# EAGLE design untitled (EAGLE 9.4.2)
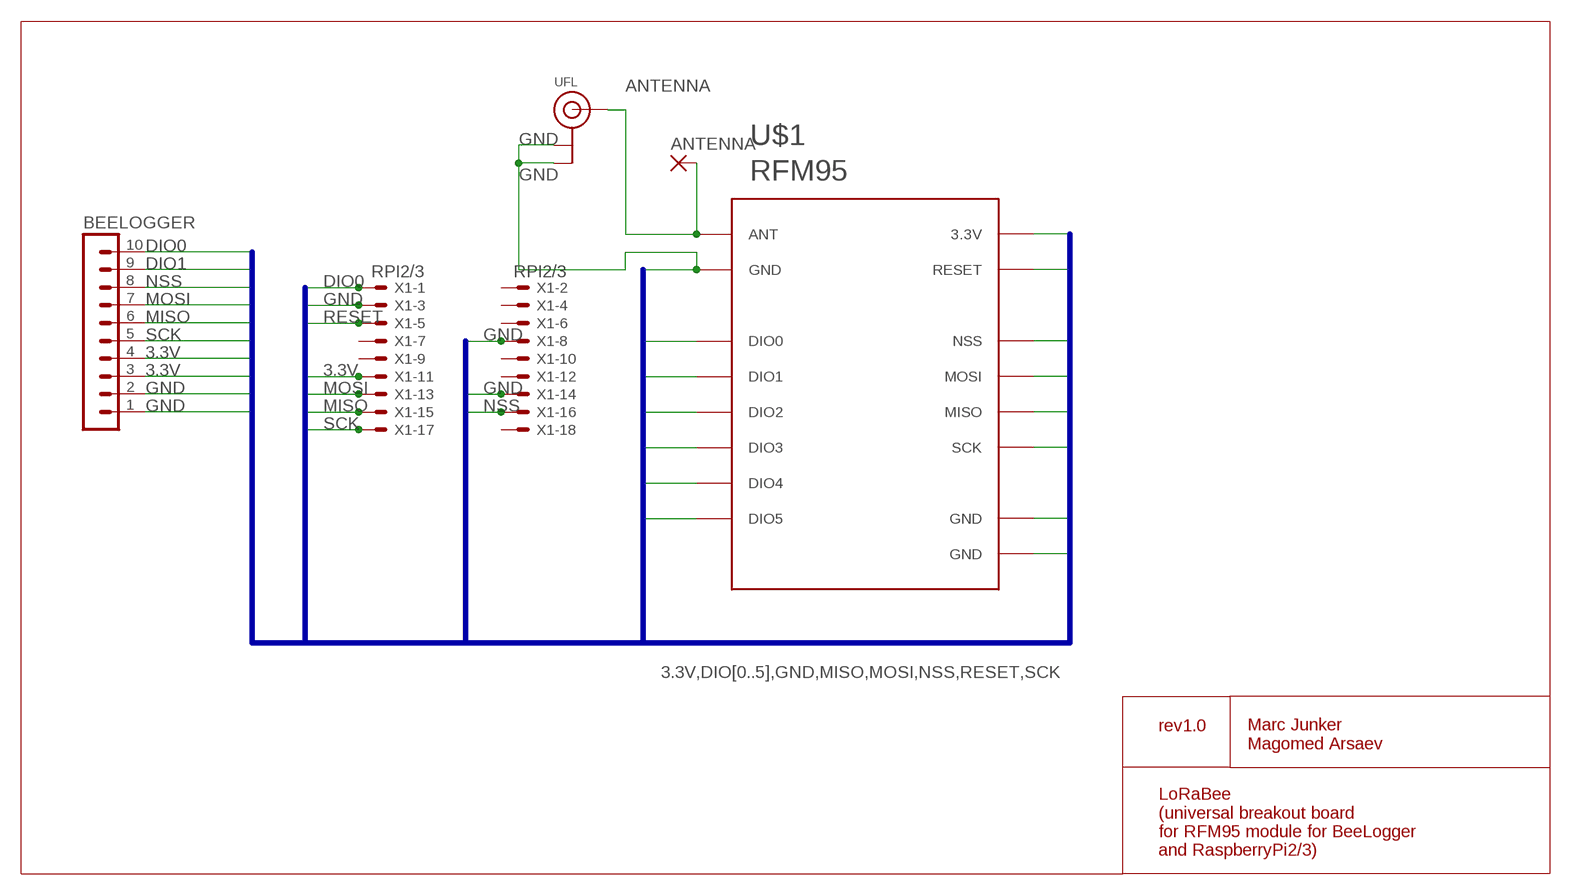
[diagram p0: schematic, sheet 1]

## Parts
ANTENNA  1,6/0,8  [1,6/0,8]
BEELOGGER  MA10-1  [MA10-1]
U$1  RFM95  [RFM95]
UFL  ANTENNA_U.FL  [U.FL]
X1  RPI2/3  332-18  [332-18]

## Nets
3.3V: BEELOGGER.3 BEELOGGER.4 U$1.P$13(3.3V) X1.11
ANTENNA: ANTENNA.1(P) U$1.P$9(ANT) UFL.3(SIGNAL)
DIO0: BEELOGGER.10 U$1.P$14(DIO0) X1.1
DIO1: BEELOGGER.9 U$1.P$15(DIO1)
DIO2: U$1.P$16(DIO2)
DIO3: U$1.P$11(DIO3)
DIO4: U$1.P$12(DIO4)
DIO5: U$1.P$7(DIO5)
GND: BEELOGGER.1 BEELOGGER.2 U$1.P$1(GND) U$1.P$8(GND) U$1.P$10(GND) UFL.1(GND) UFL.2(GND) X1.3 X1.8 X1.14
MISO: BEELOGGER.6 U$1.P$2(MISO) X1.15
MOSI: BEELOGGER.7 U$1.P$3(MOSI) X1.13
NSS: BEELOGGER.8 U$1.P$5(NSS) X1.16
RESET: U$1.P$6(RESET) X1.5
SCK: BEELOGGER.5 U$1.P$4(SCK) X1.17
Unconnected: X1.2 X1.4 X1.6 X1.7 X1.9 X1.10 X1.12 X1.18

## Buses
3.3V,DIO[0..5],GND,MISO,MOSI,NSS,RESET,SCK

## Notes on the sheet
- rev1.0
- Marc Junker
  Magomed Arsaev
- LoRaBee 
  (universal breakout board 
  for RFM95 module for BeeLogger 
  and RaspberryPi2/3)

## Library data of the parts
ANTENNA = wirepad:1,6/0,8: THROUGH-HOLE PAD
BEELOGGER = con-lstb:MA10-1: PIN HEADER; OC_FARNELL: unknown; OC_NEWARK: unknown
U$1 = LoRa_modules:RFM95
UFL = adafruit:ANTENNA_U.FL: U.FL Antenna Connector
X1 = con-garry:332-18: 18 Pin - 2mm Dual Row Source: www.mpe-connector.de / garry_shortform_2012.pdf

## Board
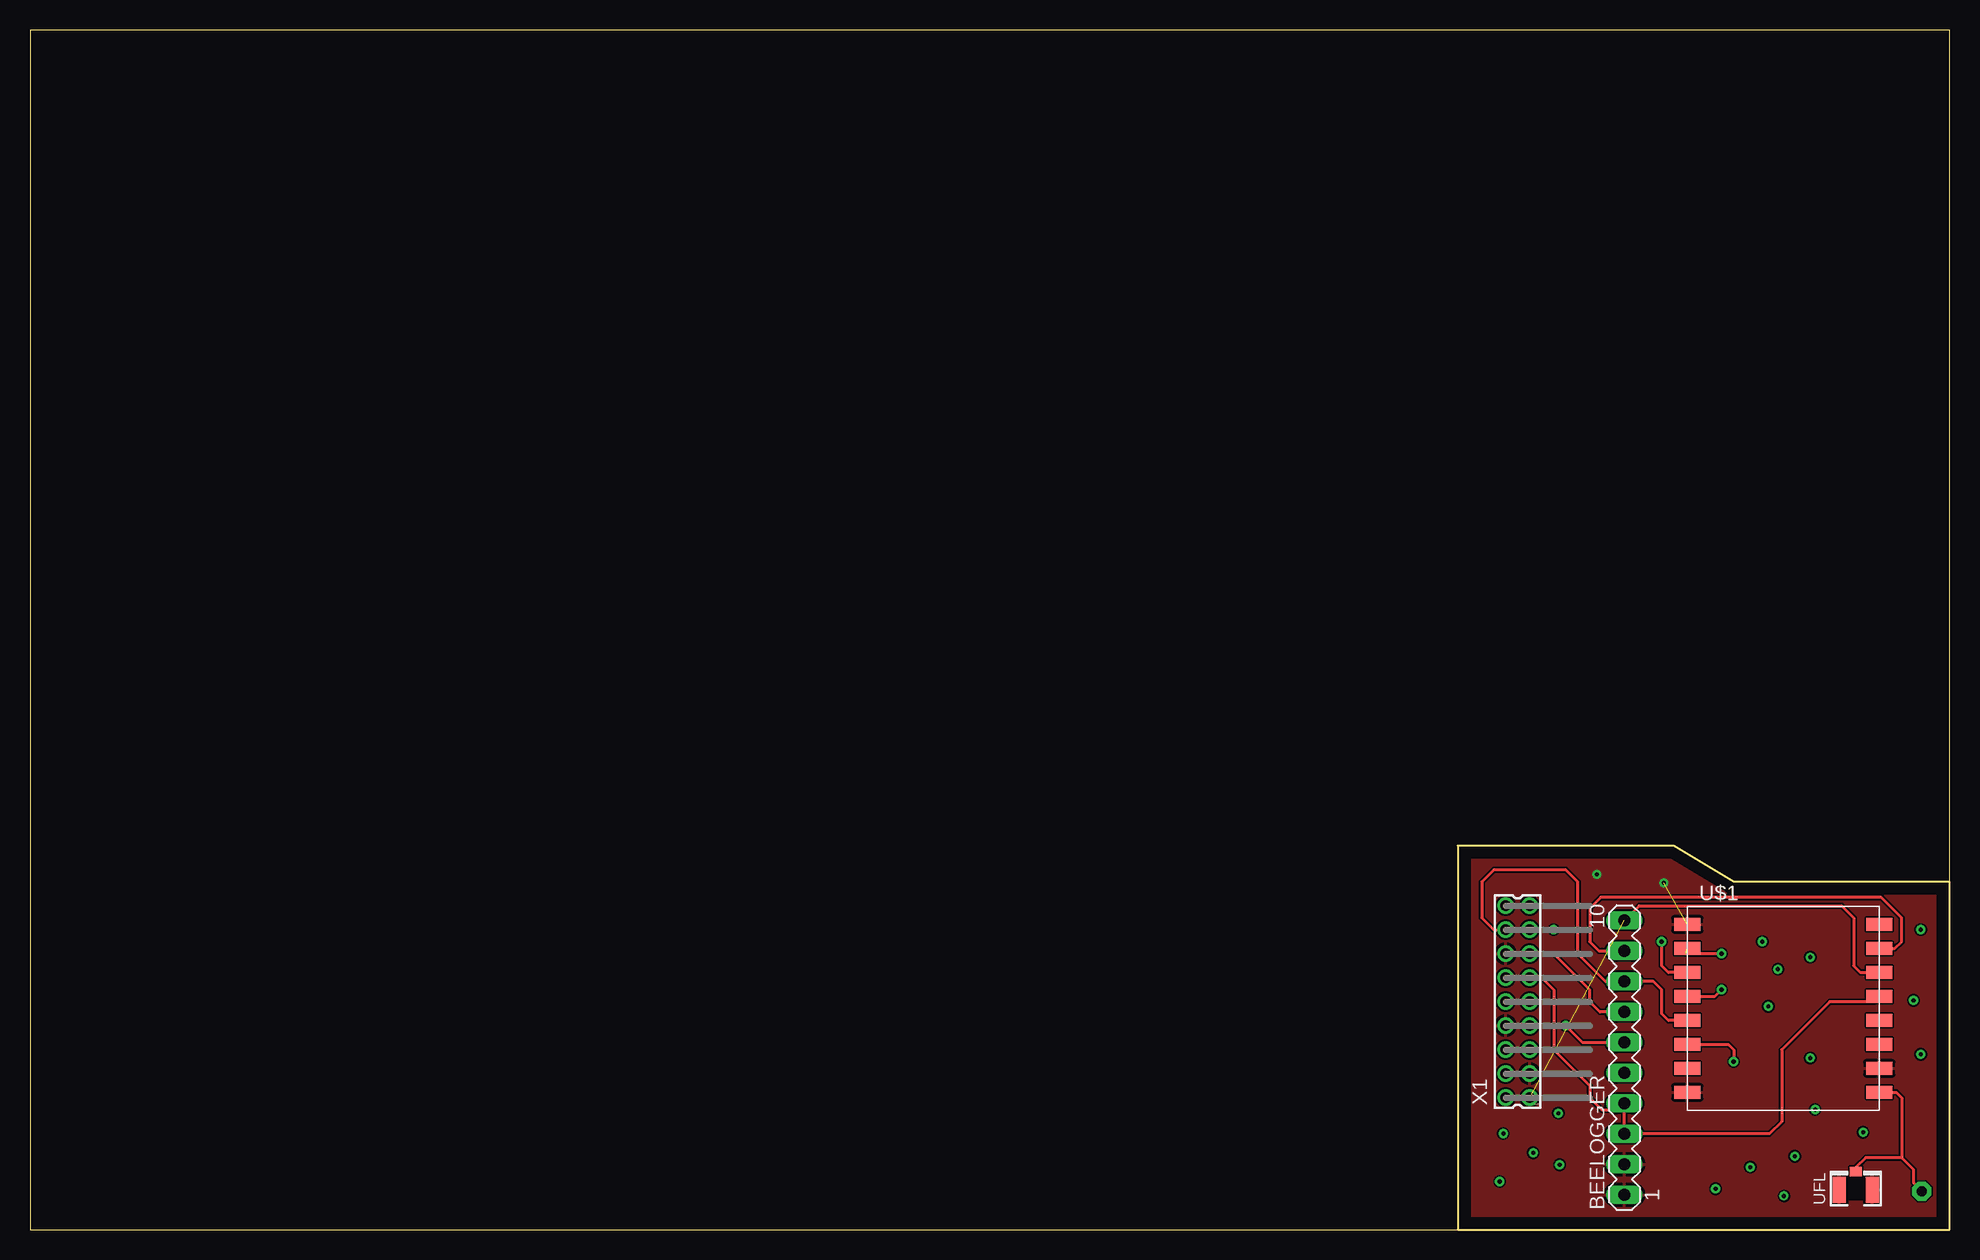
[diagram p1: board, top side]
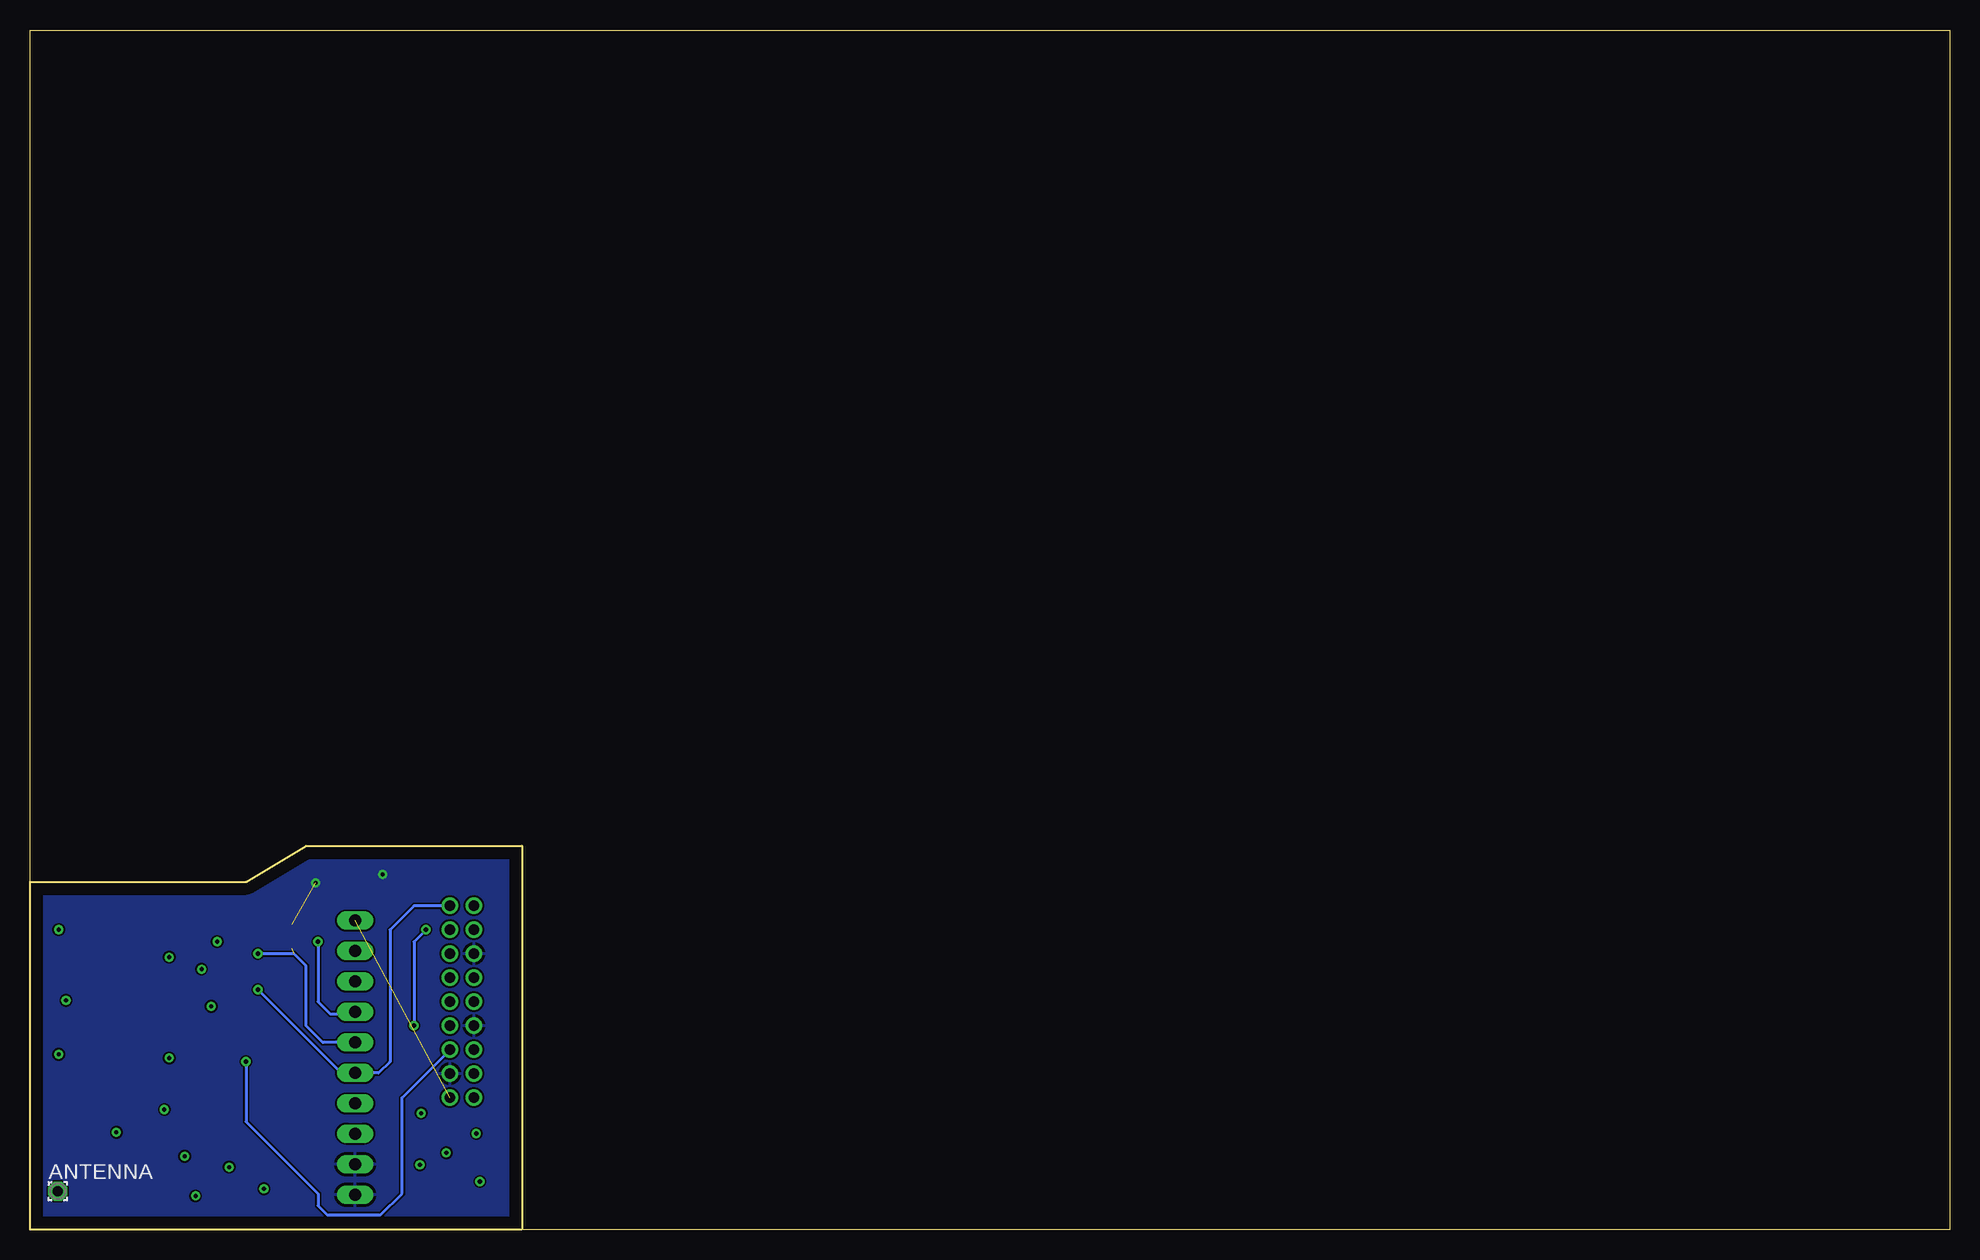
[diagram p2: board, bottom side, seen from below]

Size 160 x 100 mm. Coordinates in mm from the lower left corner, seen from the top.
Outline: 119,0 0,0 0,100 160,100 160,29
Outline: 160,29 160,0 119,0
Outline: 160,29 142,29 137,32 119,32 119,0
Copper layers (1*16): Top 0.035mm / dielectric 1.5mm / Bottom 0.035mm
Design rules "default": minimum track width 6mil, minimum drill 0.35mm, track to track 6mil, track to pad 6mil, pad to pad 6mil, via to via 6mil, smd to smd 6mil, copper to edge 40mil, drill to drill 6mil, minimum pad ring 10mil, minimum via ring 8mil, stop-mask expansion 4mil, vias tented up to drill 0mil, thermal gap 10mil

### Footprints (pad centres in the part's own frame; a part is rotated, then mirrored left to right if it is on the bottom)
1,6/0,8 = drill 0.813 pad 1.6 octagon: 1 0,0
MA10-1 = drill 1.016 long: 1 -11.43,0; 2 -8.89,0; 3 -6.35,0; 4 -3.81,0; 5 -1.27,0; 6 1.27,0; 7 3.81,0; 8 6.35,0; 9 8.89,0; 10 11.43,0
RFM95 = smd 2.184 x 1.067: P$1 -8,7; P$2 -8,5; P$3 -8,3; P$4 -8,1; P$5 -8,-1; P$6 -8,-3; P$7 -8,-5; P$8 -8,-7; P$9 8,-7; P$10 8,-5; P$11 8,-3; P$12 8,-1; P$13 8,1; P$14 8,3; P$15 8,5; P$16 8,7
U.FL = smd 2.2 x 1.05: 1 0,1.375; 2 0,-1.375 | smd 0.8 x 1: 3 1.525,0
332-18 = drill 0.9 pad 1.27: 1 -8,-1; 2 -8,1; 3 -6,-1; 4 -6,1; 5 -4,-1; 6 -4,1; 7 -2,-1; 8 -2,1; 9 0,-1; 10 0,1; 11 2,-1; 12 2,1; 13 4,-1; 14 4,1; 15 6,-1; 16 6,1; 17 8,-1; 18 8,1

### Placement (x,y rotation side)
ANTENNA  157.69,3.19 0 bottom
BEELOGGER  132.9,14.33 90 top
U$1  146.14,18.43 0 top
UFL  152.19,3.31 90 top
X1  124,19 90 top

### Tracks (layer width: path | path; a pad name or v marks a point on that pad's centre or on a via)
3.3V
  Top 0.254: 132.9,10 BEELOGGER.3 144.98,7.98 146,9 146,15 150,19 153.71,19 U$1.P$13 | 132.9,10 BEELOGGER.4 | X1.11 126,21 127,20 127,15 130,12 130,11 131,10 132.9,10
ANTENNA
  Top 0.254: ANTENNA.1 157,3.88 157,5 156,6 | 156,6 153,6 152.19,5.19 UFL.3 | U$1.P$9 155.57,11.43 156,11 156,6
DIO0  (1 unrouted)
  Top 0.254: BEELOGGER.10 134.14,27 151,27 152,26 152,22 152.57,21.43 U$1.P$14
DIO1
  Top 0.254: U$1.P$15 155.43,23.43 156,24 156,26 154.3,27.7 130.92,27.7 130,26.78 130,24 130.78,23.22 BEELOGGER.9
GND  (via drill 0.35)  (1 unrouted)
  other vias: 130.6,29.6 136.2,28.9
  pour Top: 159,29 142,29 137,32 119,32 119,0 160,0 160,29
  pour Bottom: 119,32 137,32 142,29 160,29 160,0 119,0
MISO  (via drill 0.35)  (1 unrouted)
  Top 0.254: v141,23 138,23 | X1.15 v127,25 | v128,17 129.4,15.6 BEELOGGER.6
  Bottom 0.254: BEELOGGER.6 135.6,15.6 137,17 137,22 138,23 v141,23 | v127,25 128,24 v128,17
MOSI  (via drill 0.35)
  Top 0.254: U$1.P$3 136.57,21.43 136,22 v136,24 | BEELOGGER.7 130.86,18.14 130,19 130,20 127,23 X1.13
  Bottom 0.254: BEELOGGER.7 133.04,18 135,18 136,19 v136,24
N$1  (via drill 0.35)
  other vias: 127.4,9.7
N$2  (via drill 0.35)
  other vias: 122.8,8
N$3  (via drill 0.35)
  other vias: 125.3,6.4
N$4  (via drill 0.35)
  other vias: 127.5,5.4
N$5  (via drill 0.35)
  other vias: 122.5,4
N$6  (via drill 0.35)
  other vias: 140.5,3.4
N$7  (via drill 0.35)
  other vias: 146.2,2.8
N$8  (via drill 0.35)
  other vias: 143.4,5.2
N$9  (via drill 0.35)
  other vias: 147.1,6.1
N$10  (via drill 0.35)
  other vias: 152.8,8.1
N$11  (via drill 0.35)
  other vias: 148.8,10
N$12  (via drill 0.35)
  other vias: 148.4,14.3
N$13  (via drill 0.35)
  other vias: 157.6,14.6
N$14  (via drill 0.35)
  other vias: 157,19.1
N$15  (via drill 0.35)
  other vias: 157.6,25
N$16  (via drill 0.35)
  other vias: 148.4,22.7
N$17  (via drill 0.35)
  other vias: 144.9,18.6
N$18  (via drill 0.35)
  other vias: 144.4,24
N$19  (via drill 0.35)
  other vias: 145.7,21.7
NSS
  Top 0.254: U$1.P$5 136.57,17.43 136,18 136,20 135.32,20.68 BEELOGGER.8 131.32,20.68 129,23 129,29 128,30 122,30 121,29 121,26 122,25 X1.16
RESET  (via drill 0.35)
  Top 0.254: U$1.P$6 141.57,15.43 142,15 v142,14
  Bottom 0.254: v142,14 142,9 136,3 136,2 135.22,1.22 130.78,1.22 129,3 129,11 X1.5
SCK  (via drill 0.35)
  Top 0.254: U$1.P$4 140.43,19.43 v141,20
  Bottom 0.254: v141,20 134.06,13.06 BEELOGGER.5 130.94,13.06 130,14 130,25 128,27 X1.17